# Altium project Ali_Main_Board.PrjPCB
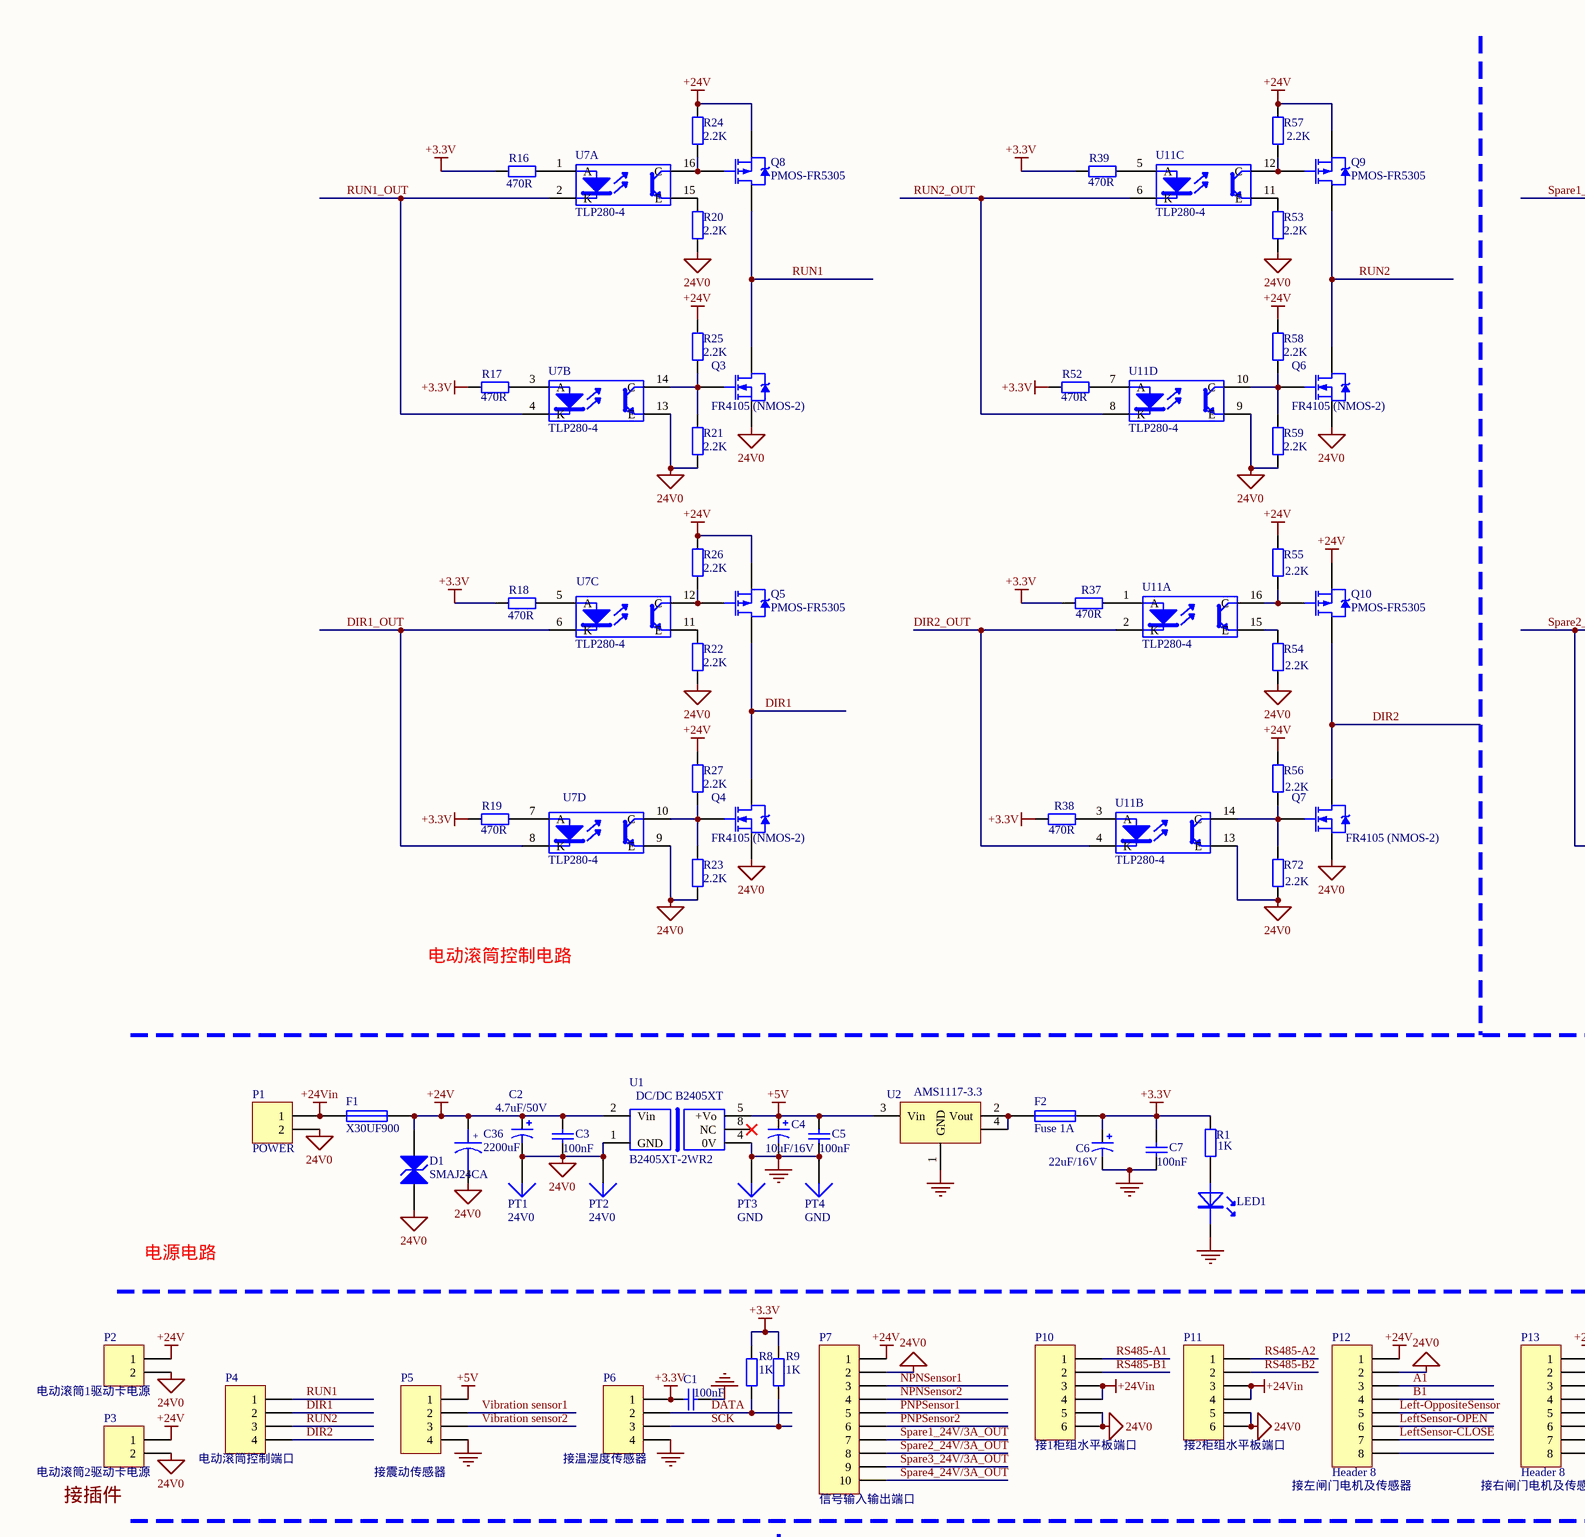
[diagram p0: Ali_Main_Board.SchDoc, top left]
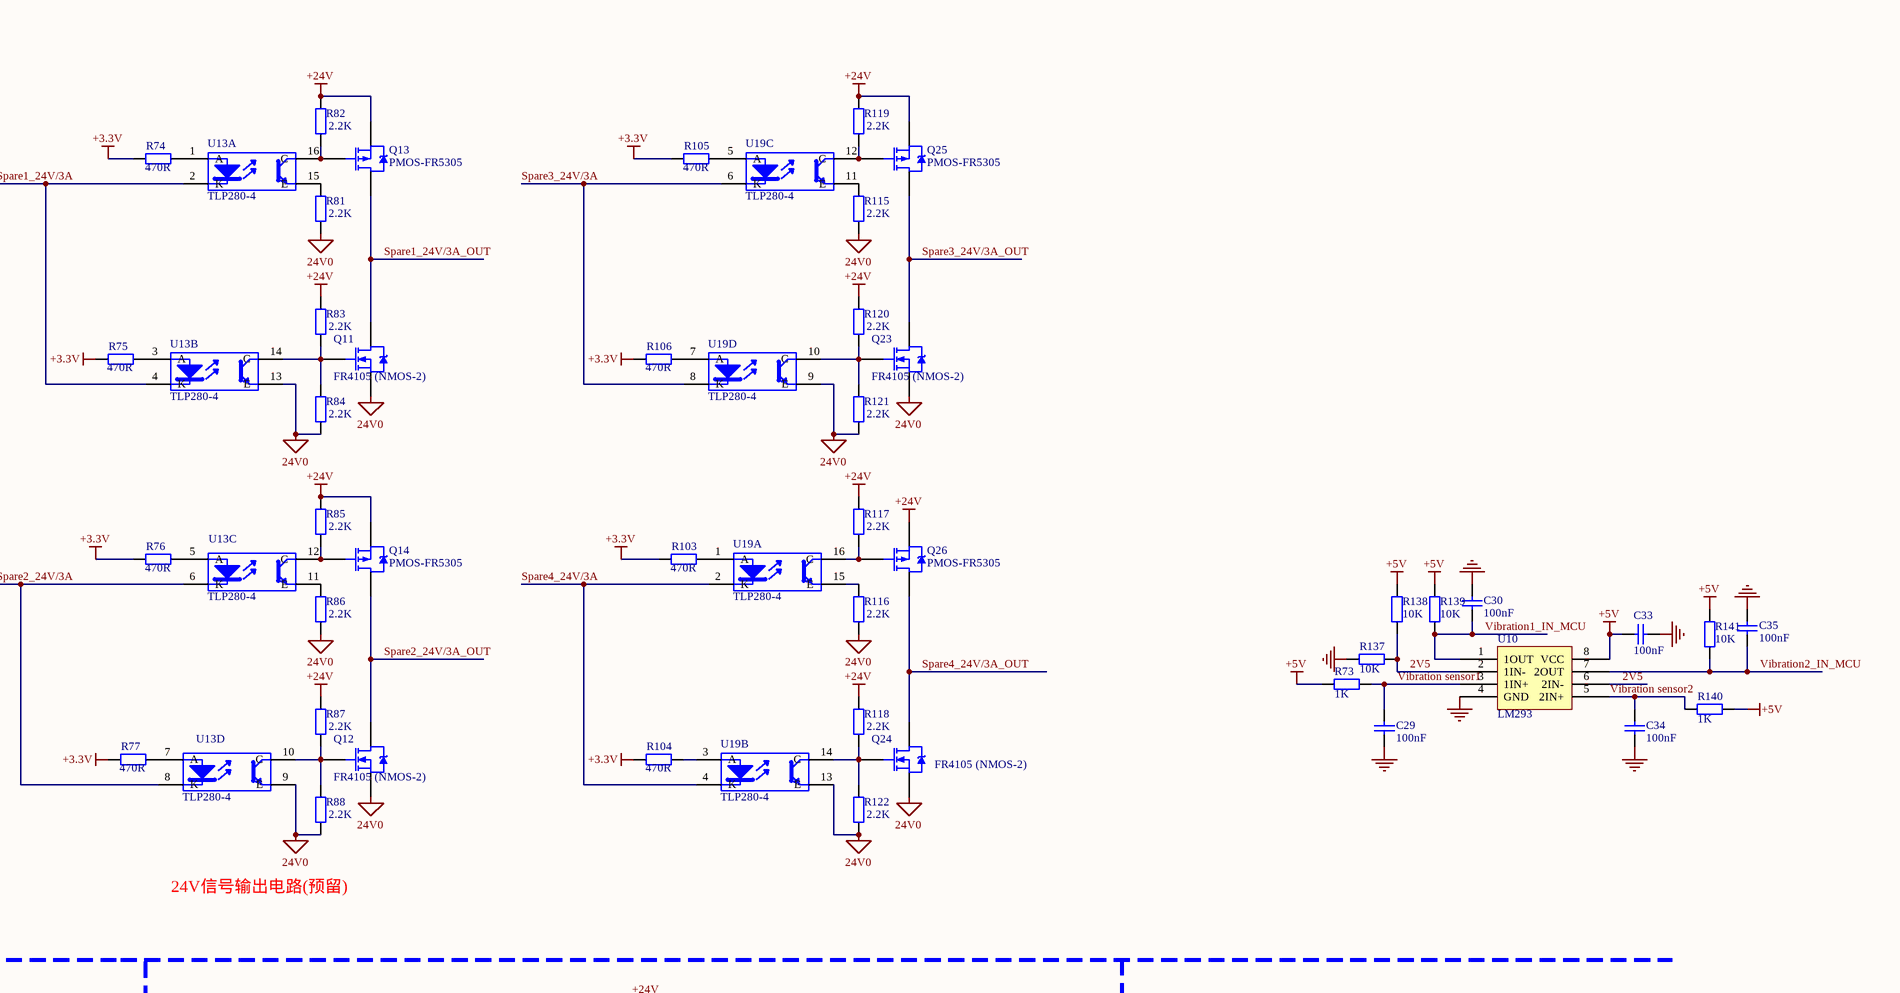
[diagram p1: Ali_Main_Board.SchDoc, top right]
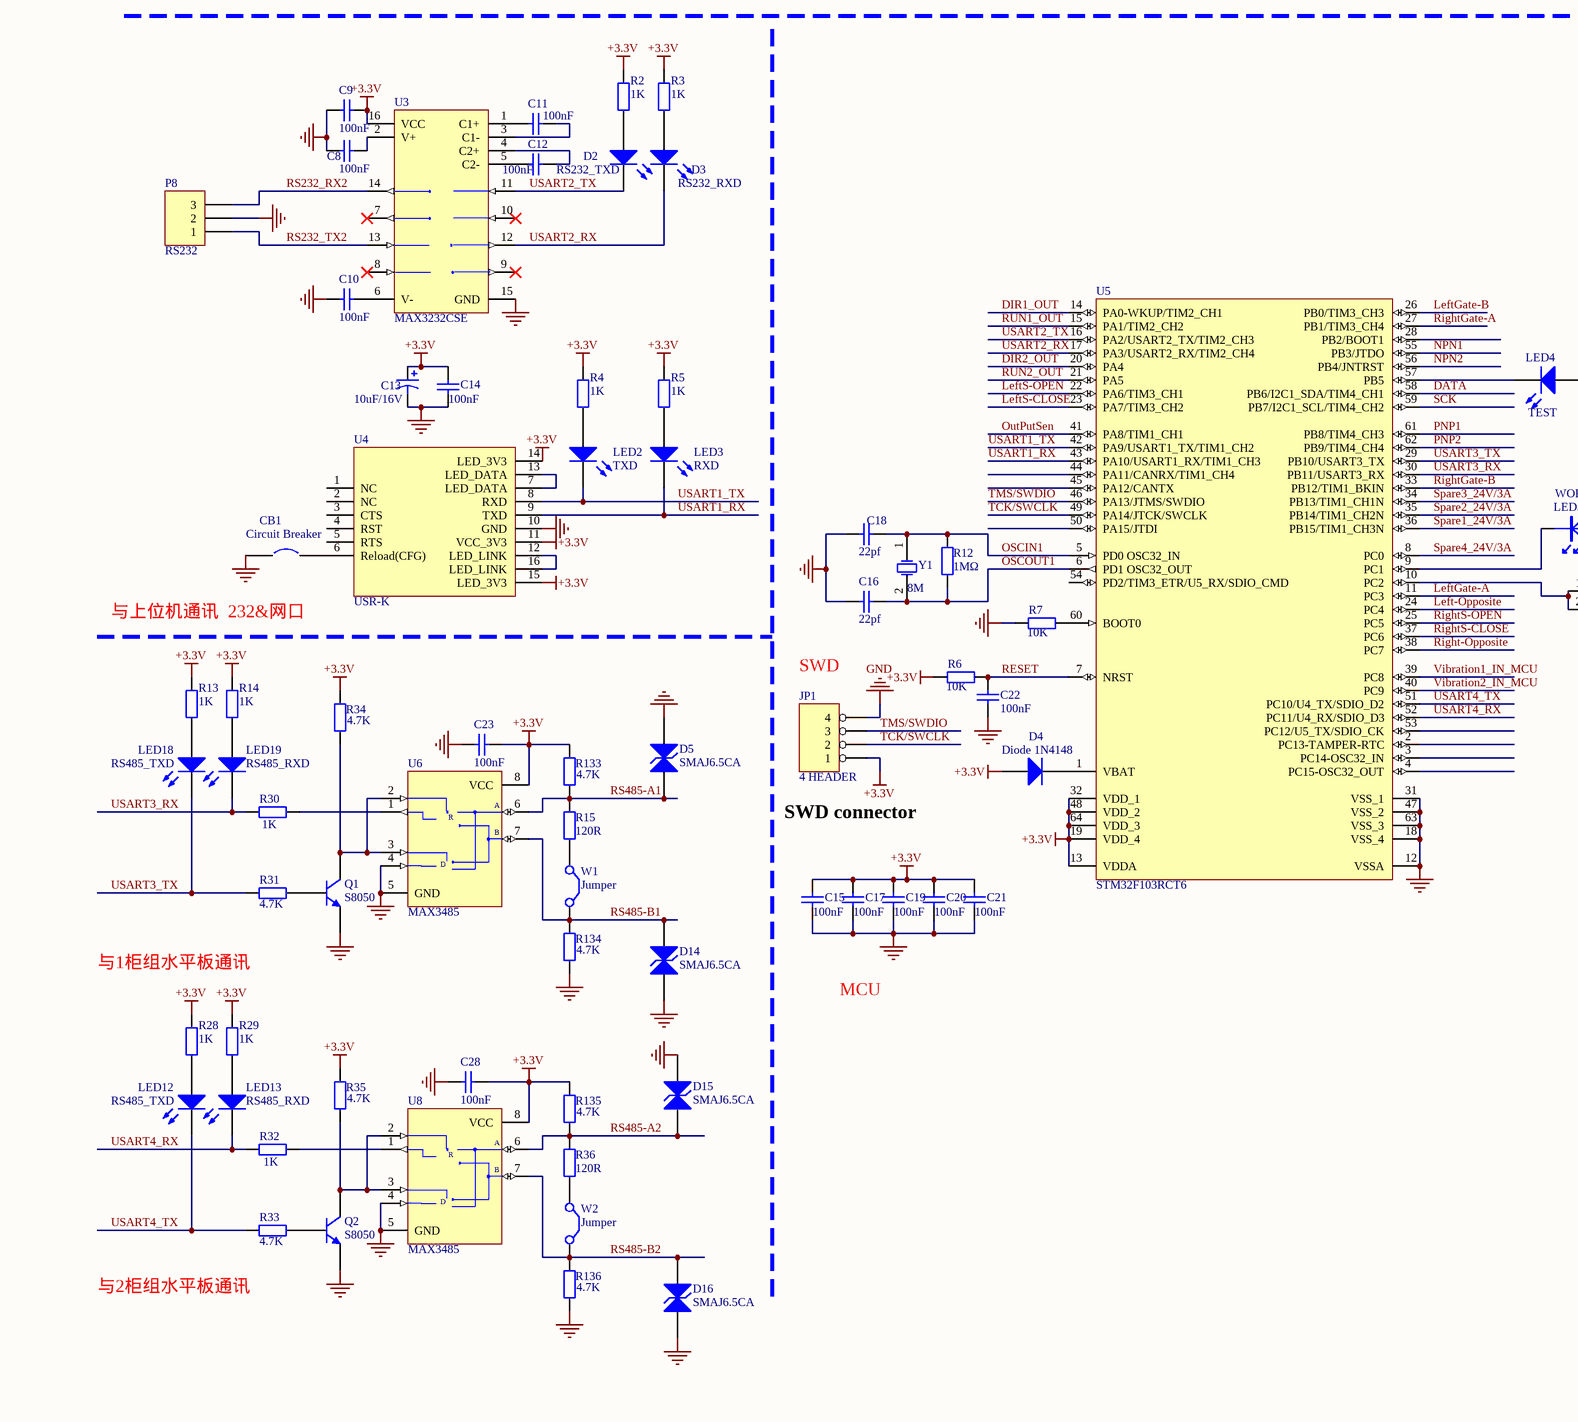
[diagram p2: Ali_Main_Board.SchDoc, bottom left]
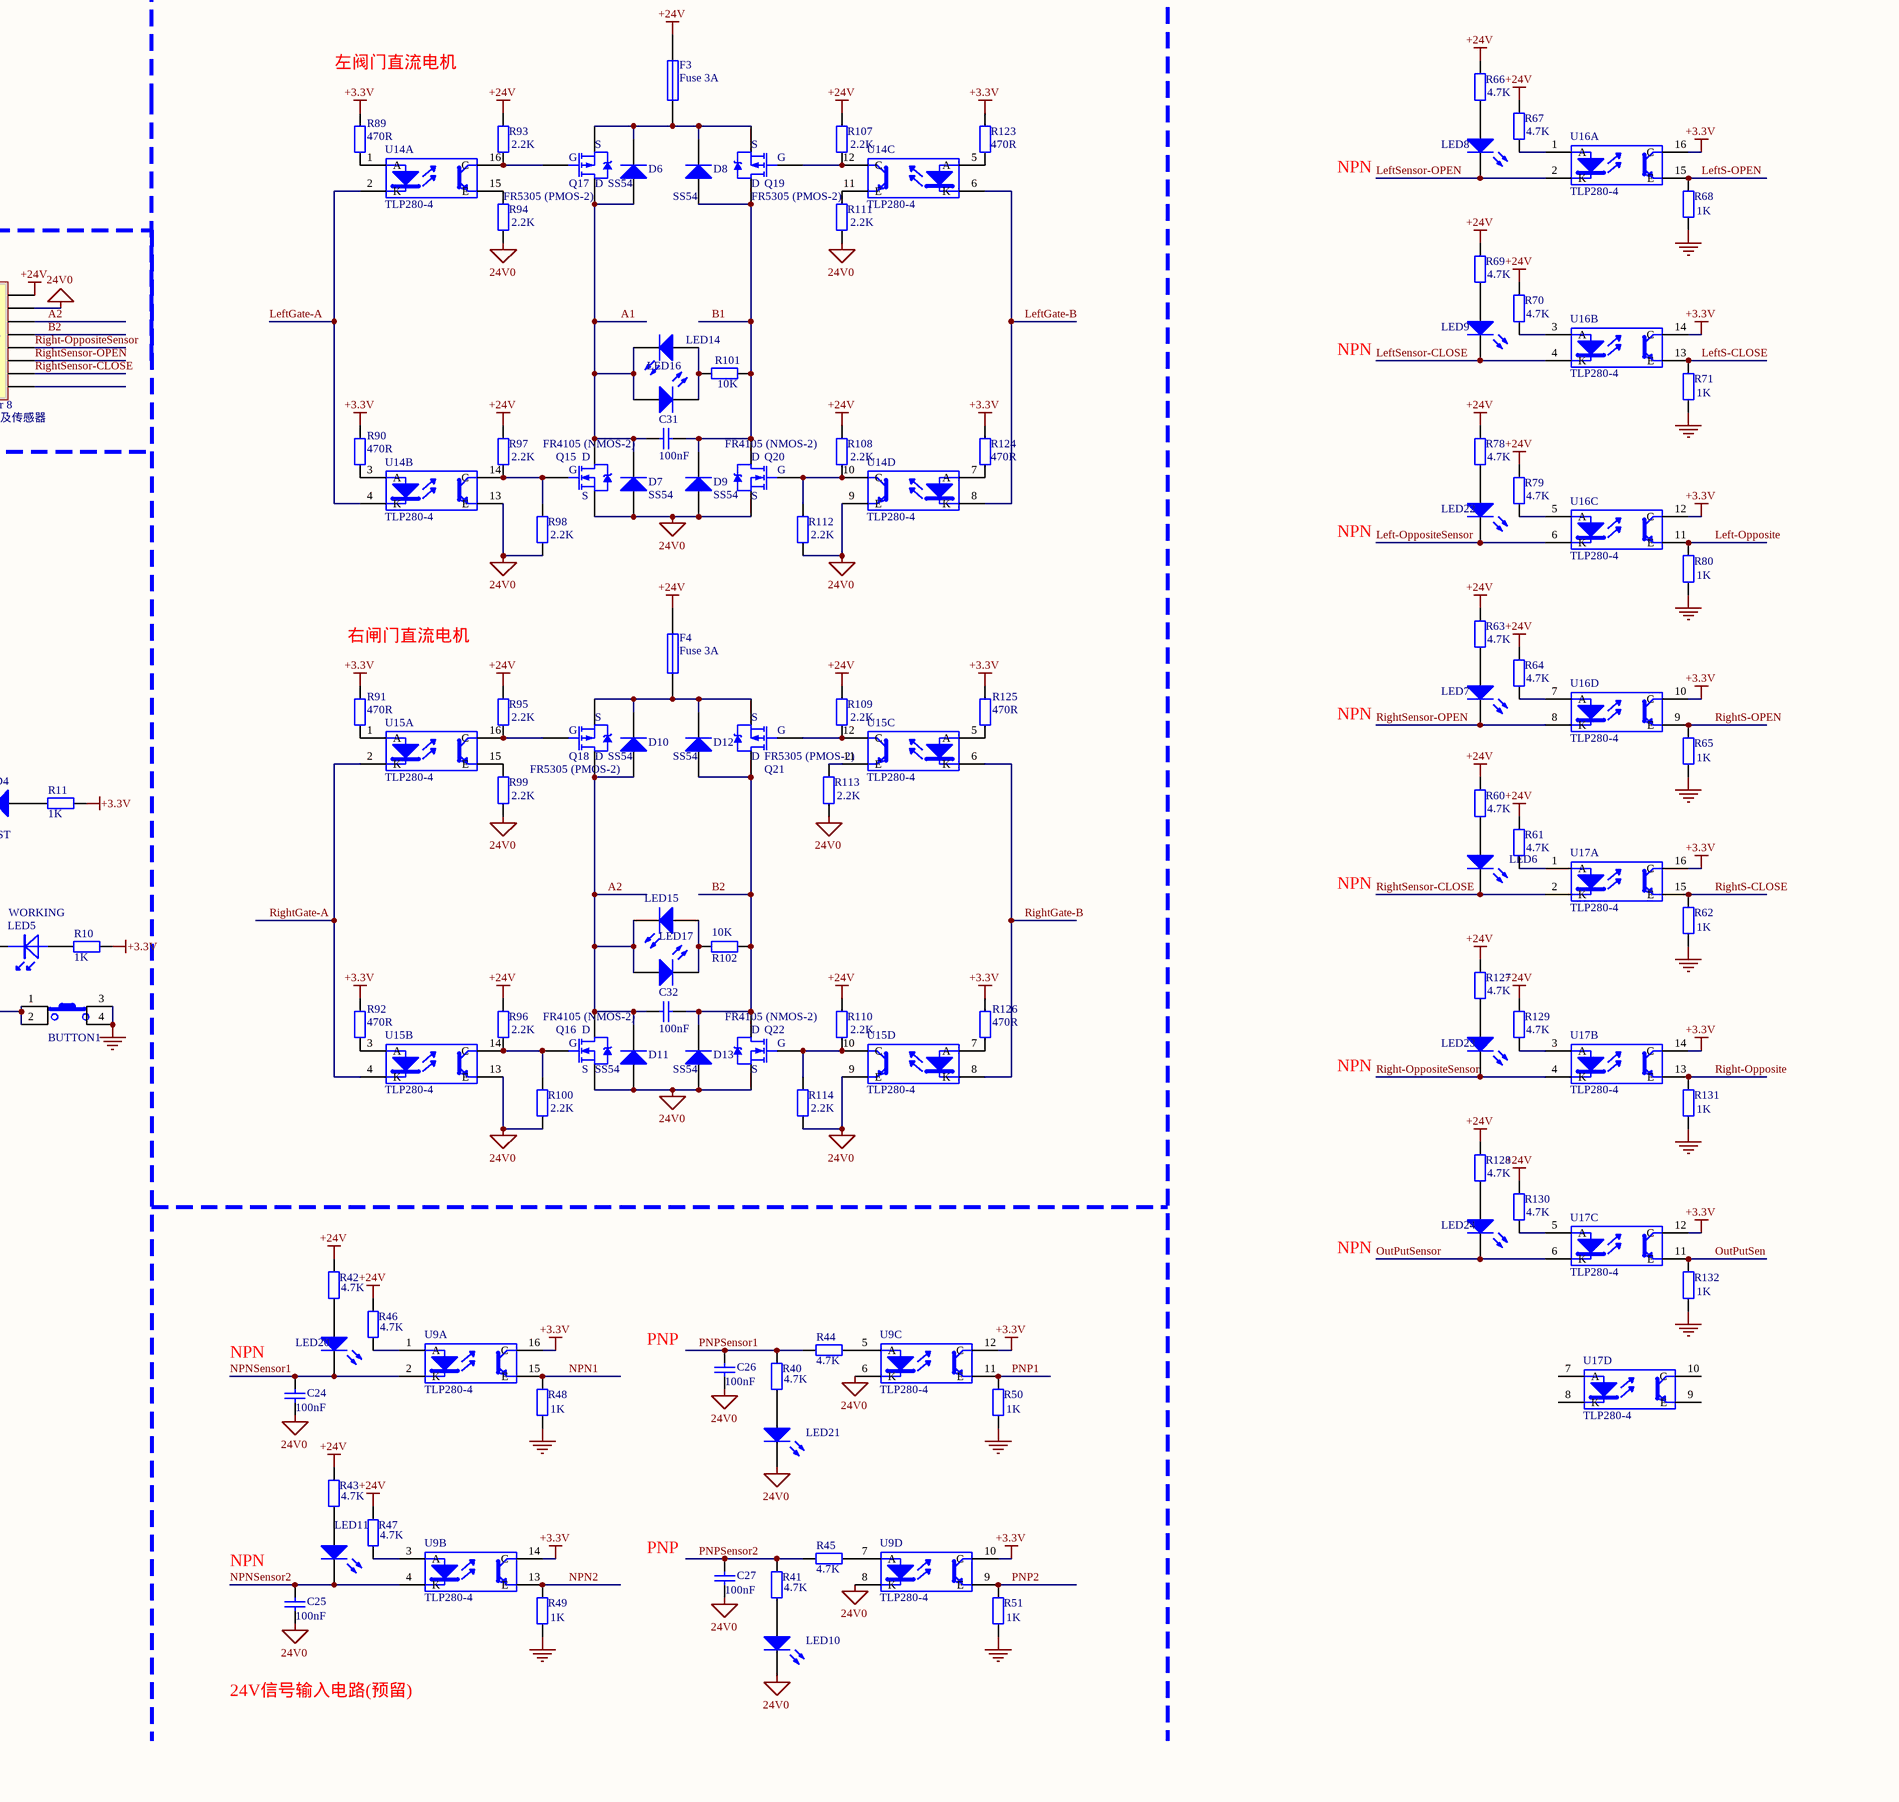
[diagram p3: Ali_Main_Board.SchDoc, bottom right]
1 sheet, 286 parts. Net scope: global (net labels, ports and power ports of the same name join across sheets).
Board file: Ali_Main_Board.PcbDoc

## Sheet Ali_Main_Board.SchDoc
size A1

### Parts
BUTTON1  SW4  [BUTTON]  (value not drawn)
C1  100nF  [0805]
C2  value 4.7uF/50V  [CAP D-7343]  (hidden comment: Cap Pol3)
C3  100nF  [0805]
C4  value 10uF/16V  [CAP A-3216]  (hidden comment: Cap Pol3)
C5  100nF  [0805]
C6  value 22uF/16V  [CAP D-7343]  (hidden comment: Cap Pol3)
C7  100nF  [0805]
C8  100nF  [0805]
C9  100nF  [0805]
C10  100nF  [0805]
C11  100nF  [0805]
C12  100nF  [0805]
C13  value 10uF/16V  [CAP A-3216]  (hidden comment: Cap Pol3)
C14  100nF  [0805]
C15  100nF  [0805]
C16  value 22pf  [0805]
C17  100nF  [0805]
C18  value 22pf  [0805]
C19  100nF  [0805]
C20  100nF  [0805]
C21  100nF  [0805]
C22  value 100nF  [0805]  (hidden comment: Cap)
C23  100nF  [0805]
C24  value 100nF  [0805]  (hidden comment: Cap)
C25  value 100nF  [0805]  (hidden comment: Cap)
C26  value 100nF  [0805]  (hidden comment: Cap)
C27  value 100nF  [0805]  (hidden comment: Cap)
C28  100nF  [0805]
C29  100nF  [0805]
C30  100nF  [0805]
C31  100nF  [0805]
C32  100nF  [0805]
C33  100nF  [0805]
C34  100nF  [0805]
C35  100nF  [0805]
C36  C_2200uF  [C7.8*17]  (value not drawn)
CB1  Circuit Breaker  [HDR1X2]
D1  SMAJ24CA  [SMB(DO-214AA)_S1]
D2  RS232_TXD  [LED-0805]
D3  RS232_RXD  [LED-0805]
D4  Diode 1N4148  [LED-0805]
D5  SMAJ6.5CA  [SMA(DO-214AC)_S1]
D6  SS54  [SMA]
D7  SS54  [SMA]
D8  SS54  [SMA]
D9  SS54  [SMA]
D10  SS54  [SMA]
D11  SS54  [SMA]
D12  SS54  [SMA]
D13  SS54  [SMA]
D14  SMAJ6.5CA  [SMA(DO-214AC)_S1]
D15  SMAJ6.5CA  [SMA(DO-214AC)_S1]
D16  SMAJ6.5CA  [SMA(DO-214AC)_S1]
F1  X30UF900  [X30UF900]
F2  Fuse 1A  [3225[1210]]
F3  Fuse 3A  [3225[1210]]
F4  Fuse 3A  [3225[1210]]
JP1  4 HEADER  [CON4_1.5]
LED1  LED  [LED-0805]  (value not drawn)
LED2  TXD  [LED-0805]
LED3  RXD  [LED-0805]
LED4  TEST  [LED-0805]
LED5  WORKING  [LED-0805]
LED6  LED  [LED-0805]  (value not drawn)
LED7  LED  [LED-0805]  (value not drawn)
LED8  LED  [LED-0805]  (value not drawn)
LED9  LED  [LED-0805]  (value not drawn)
LED10  LED  [LED-0805]  (value not drawn)
LED11  LED  [LED-0805]  (value not drawn)
LED12  RS485_TXD  [LED-0805]
LED13  RS485_RXD  [LED-0805]
LED14  LED  [LED-0805]  (value not drawn)
LED15  LED  [LED-0805]  (value not drawn)
LED16  LED  [LED-0805]  (value not drawn)
LED17  LED  [LED-0805]  (value not drawn)
LED18  RS485_TXD  [LED-0805]
LED19  RS485_RXD  [LED-0805]
LED20  LED  [LED-0805]  (value not drawn)
LED21  LED  [LED-0805]  (value not drawn)
LED22  LED  [LED-0805]  (value not drawn)
LED23  LED  [LED-0805]  (value not drawn)
LED24  LED  [LED-0805]  (value not drawn)
P1  POWER  [VH3.96  2PIN]
P2  电动滚筒1驱动卡电源  [VH3.96  2PIN]
P3  电动滚筒2驱动卡电源  [VH3.96  2PIN]
P4  电动滚筒控制端口  [VH3.96  4PIN]
P5  接震动传感器  [VH3.96  4PIN]
P6  接温湿度传感器  [VH3.96  4PIN]
P7  信号输入输出端口  [VH3.96  10PIN]
P8  RS232  [VH3.96  3PIN]
P10  接1柜组水平板端口  [VH3.96  6PIN]
P11  接2柜组水平板端口  [VH3.96  6PIN]
P12  Header 8  [VH3.96  8PIN]
P13  Header 8  [VH3.96  8PIN]
PT1  24V0  [PLUG]
PT2  24V0  [PLUG]
PT3  GND  [PLUG]
PT4  GND  [PLUG]
Q1  S8050  [SOT-23(SOT-23-3)]
Q2  S8050  [SOT-23(SOT-23-3)]
Q3  FR4105 (NMOS-2)  [TO-252]
Q4  FR4105 (NMOS-2)  [TO-252]
Q5  PMOS-FR5305  [TO-252]
Q6  FR4105 (NMOS-2)  [TO-252]
Q7  FR4105 (NMOS-2)  [TO-252]
Q8  PMOS-FR5305  [TO-252]
Q9  PMOS-FR5305  [TO-252]
Q10  PMOS-FR5305  [TO-252]
Q11  FR4105 (NMOS-2)  [TO-252]
Q12  FR4105 (NMOS-2)  [TO-252]
Q13  PMOS-FR5305  [TO-252]
Q14  PMOS-FR5305  [TO-252]
Q15  FR4105 (NMOS-2)  [TO-252]
Q16  FR4105 (NMOS-2)  [TO-252]
Q17  FR5305 (PMOS-2)  [TO-252]
Q18  FR5305 (PMOS-2)  [TO-252]
Q19  FR5305 (PMOS-2)  [TO-252]
Q20  FR4105 (NMOS-2)  [TO-252]
Q21  FR5305 (PMOS-2)  [TO-252]
Q22  FR4105 (NMOS-2)  [TO-252]
Q23  FR4105 (NMOS-2)  [TO-252]
Q24  FR4105 (NMOS-2)  [TO-252]
Q25  PMOS-FR5305  [TO-252]
Q26  PMOS-FR5305  [TO-252]
R1  1K  [0805]
R2  1K  [0805]
R3  1K  [0805]
R4  1K  [0805]
R5  1K  [0805]
R6  10K  [0805]
R7  10K  [0805]
R8  1K  [0805]
R9  1K  [0805]
R10  1K  [0805]
R11  1K  [0805]
R12  1MΩ  [0805]
R13  1K  [0805]
R14  1K  [0805]
R15  120R  [0805]
R16  470R  [0805]
R17  470R  [0805]
R18  470R  [0805]
R19  470R  [0805]
R20  2.2K  [0805]
R21  2.2K  [0805]
R22  2.2K  [0805]
R23  2.2K  [0805]
R24  2.2K  [0805]
R25  2.2K  [0805]
R26  2.2K  [0805]
R27  2.2K  [0805]
R28  1K  [0805]
R29  1K  [0805]
R30  1K  [0805]
R31  4.7K  [0805]
R32  1K  [0805]
R33  4.7K  [0805]
R34  4.7K  [0805]
R35  4.7K  [0805]
R36  120R  [0805]
R37  470R  [0805]
R38  470R  [0805]
R39  470R  [0805]
R40  4.7K  [0805]
R41  4.7K  [0805]
R42  4.7K  [0805]
R43  4.7K  [0805]
R44  4.7K  [0805]
R45  4.7K  [0805]
R46  4.7K  [0805]
R47  4.7K  [0805]
R48  1K  [0805]
R49  1K  [0805]
R50  1K  [0805]
R51  1K  [0805]
R52  470R  [0805]
R53  2.2K  [0805]
R54  2.2K  [0805]
R55  2.2K  [0805]
R56  2.2K  [0805]
R57  2.2K  [0805]
R58  2.2K  [0805]
R59  2.2K  [0805]
R60  4.7K  [0805]
R61  4.7K  [0805]
R62  1K  [0805]
R63  4.7K  [0805]
R64  4.7K  [0805]
R65  1K  [0805]
R66  4.7K  [0805]
R67  4.7K  [0805]
R68  1K  [0805]
R69  4.7K  [0805]
R70  4.7K  [0805]
R71  1K  [0805]
R72  2.2K  [0805]
R73  1K  [0805]
R74  470R  [0805]
R75  470R  [0805]
R76  470R  [0805]
R77  470R  [0805]
R78  4.7K  [0805]
R79  4.7K  [0805]
R80  1K  [0805]
R81  2.2K  [0805]
R82  2.2K  [0805]
R83  2.2K  [0805]
R84  2.2K  [0805]
R85  2.2K  [0805]
R86  2.2K  [0805]
R87  2.2K  [0805]
R88  2.2K  [0805]
R89  470R  [0805]
R90  470R  [0805]
R91  470R  [0805]
R92  470R  [0805]
R93  2.2K  [0805]
R94  2.2K  [0805]
R95  2.2K  [0805]
R96  2.2K  [0805]
R97  2.2K  [0805]
R98  2.2K  [0805]
R99  2.2K  [0805]
R100  2.2K  [0805]
R101  10K  [0805]
R102  10K  [0805]
R103  470R  [0805]
R104  470R  [0805]
R105  470R  [0805]
R106  470R  [0805]
R107  2.2K  [0805]
R108  2.2K  [0805]
R109  2.2K  [0805]
R110  2.2K  [0805]
R111  2.2K  [0805]
R112  2.2K  [0805]
R113  2.2K  [0805]
R114  2.2K  [0805]
R115  2.2K  [0805]
R116  2.2K  [0805]
R117  2.2K  [0805]
R118  2.2K  [0805]
R119  2.2K  [0805]
R120  2.2K  [0805]
R121  2.2K  [0805]
R122  2.2K  [0805]
R123  value 470R  [0805]  (hidden comment: Res2)
R124  value 470R  [0805]  (hidden comment: Res2)
R125  470R  [0805]
R126  470R  [0805]
R127  4.7K  [0805]
R128  4.7K  [0805]
R129  4.7K  [0805]
R130  4.7K  [0805]
R131  1K  [0805]
R132  1K  [0805]
R133  4.7K  [0805]
R134  4.7K  [0805]
R135  4.7K  [0805]
R136  4.7K  [0805]
R137  10K  [0805]
R138  10K  [0805]
R139  10K  [0805]
R140  1K  [0805]
R141  10K  [0805]
U1  B2405XT-2WR2  [B2405XT-2WR2]
U2  AMS1117-3.3  [SOT223]
U3  MAX3232CSE  [SOIC-16_150mil]
U4  USR-K  [USR-K]
U5  STM32F103RCT6  [LQFP64_M]
U6  MAX3485  [AT24C512]
U7  TLP280-4  [SO16]  (parts A,B,C,D of 4)
U8  MAX3485  [AT24C512]
U9  TLP280-4  [SO16]  (parts A,B,C,D of 4)
U10  LM293  [SOIC-8_150mil]
U11  TLP280-4  [SO16]  (parts A,B,C,D of 4)
U13  TLP280-4  [SO16]  (parts A,B,C,D of 4)
U14  TLP280-4  [SO16]  (parts A,B,C,D of 4)
U15  TLP280-4  [SO16]  (parts A,B,C,D of 4)
U16  TLP280-4  [SO16]  (parts A,B,C,D of 4)
U17  TLP280-4  [SO16]  (parts A,B,C,D of 4)
U19  TLP280-4  [SO16]  (parts A,B,C,D of 4)
W1  Jumper  [HDR1X2]
W2  Jumper  [HDR1X2]
Y1  8M  [XTAL]

### Nets
24V0: C2.2 C3.1 C24.1 C25.1 C26.1 C27.1 C36.2 D1.1(A) D7.1(A) D9.1(A) D11.1(A) D13.1(A) LED10.2(K) LED21.2(K) P1.2 P2.2 P3.2 P7.2 P10.5 P10.6 P11.5 P11.6 P12.2 P13.2 PT1.1 PT2.1 Q3.3(S) Q4.3(S) Q6.3(S) Q7.3(S) Q11.3(S) Q12.3(S) Q15.3(S) Q16.3(S) Q20.3(S) Q22.3(S) Q23.3(S) Q24.3(S) R20.1 R21.1 R22.1 R23.1 R53.1 R54.1 R59.1 R72.1 R81.1 R84.1 R86.1 R88.1 R94.1 R98.1 R99.1 R100.1 R111.1 R112.1 R113.1 R114.1 R115.1 R116.1 R121.1 R122.1 U1.1(GND) U7.9(E) U7.13(E) U9.6(K) U9.8(K) U11.9(E) U11.13(E) U13.9(E) U13.13(E) U14.9(E) U14.13(E) U15.9(E) U15.13(E) U19.9(E) U19.13(E)
+3.3V: C1.2 C6.1 C7.2 C9.1 C13.1 C14.2 C15.2 C17.2 C19.2 C20.2 C21.2 C23.1 C28.1 D4.1(A) F2.2 JP1.1 P6.1 R1.1 R2.1 R3.1 R4.1 R5.1 R6.1 R8.1 R9.1 R10.1 R11.1 R13.1 R14.1 R16.2 R17.1 R18.1 R19.1 R28.1 R29.1 R34.1 R35.1 R37.1 R38.1 R39.2 R52.1 R74.2 R75.2 R76.2 R77.2 R89.1 R90.1 R91.1 R92.1 R103.2 R104.2 R105.2 R106.2 R123.2 R124.2 R125.1 R126.1 R133.1 R135.1 U3.16(VCC) U4.11(VCC_3V3) U4.14(LED_3V3) U4.15(LED_3V3) U5.13(VDDA) U5.19(VDD_4) U5.32(VDD_1) U5.48(VDD_2) U5.64(VDD_3) U6.8(VCC) U8.8(VCC) U9.10(C) U9.12(C) U9.14(C) U9.16(C) U16.10(C) U16.12(C) U16.14(C) U16.16(C) U17.12(C) U17.14(C) U17.16(C)
+5V: C4.1 C5.2 C33.2 P5.1 R73.1 R138.2 R139.2 R140.1 R141.2 U1.5(+Vo) U2.3(Vin) U10.8(VCC)
+24V: C2.1 C3.2 C36.1 D1.2(K) F1.2 F3.2 F4.2 P2.1 P3.1 P7.1 P12.1 P13.1 Q5.3(S) Q8.3(S) Q9.3(S) Q10.3(S) Q13.3(S) Q14.3(S) Q25.3(S) Q26.3(S) R24.2 R25.2 R26.2 R27.2 R42.1 R43.1 R46.1 R47.1 R55.2 R56.2 R57.2 R58.2 R60.1 R61.1 R63.1 R64.1 R66.1 R67.1 R69.1 R70.1 R78.1 R79.1 R82.2 R83.2 R85.2 R87.2 R93.2 R95.2 R96.2 R97.2 R107.2 R108.2 R109.2 R110.2 R117.2 R118.2 R119.2 R120.2 R127.1 R128.1 R129.1 R130.1 U1.2(Vin)
+24Vin: F1.1 P1.1 P10.3 P10.4 P11.3 P11.4
GND: BUTTON1.3 BUTTON1.4 C1.1 C4.2 C5.1 C6.2 C7.1 C8.2 C9.2 C10.2 C13.2 C14.1 C15.1 C16.1 C17.1 C18.1 C19.1 C20.1 C21.1 C22.1 C23.2 C28.2 C29.2 C30.1 C33.1 C34.2 C35.1 CB1.1 D5.2(K) D14.1(A) D15.2(K) D16.1(A) JP1.4 LED1.2 P5.4 P6.4 P8.2 PT3.1 PT4.1 Q1.2(E) Q2.2(E) R7.1 R48.1 R49.1 R50.1 R51.1 R62.1 R65.1 R68.1 R71.1 R80.1 R131.1 R132.1 R134.2 R136.2 R137.2 U1.4(0V) U2.1(GND) U3.15(GND) U4.10(GND) U5.12(VSSA) U5.18(VSS_4) U5.31(VSS_1) U5.47(VSS_2) U5.63(VSS_3) U6.4(DI) U6.5(GND) U8.4(DI) U8.5(GND) U10.4(GND)
2V5: R137.1 R138.1 U10.2(1IN-) U10.6(2IN-)
A1: C31.2 D6.1(A) D7.2(K) LED14.2(K) LED16.1(A) P12.3 Q15.2(D) Q17.2(D)
A2: C32.2 D10.1(A) D11.2(K) LED15.2(K) LED17.1(A) P13.3 Q16.2(D) Q18.2(D)
B1: C31.1 D8.1(A) D9.2(K) P12.4 Q19.2(D) Q20.2(D) R101.1
B2: C32.1 D12.1(A) D13.2(K) P13.4 Q21.2(D) Q22.2(D) R102.1
DATA: P6.2 R8.2 U5.58(PB6/I2C1_SDA/TIM4_CH1)
DIR1: P4.2 Q4.2(D) Q5.2(D)
DIR1_OUT: U5.14(PA0-WKUP/TIM2_CH1) U7.6(K) U7.8(K)
DIR2: P4.4 Q7.2(D) Q10.2(D)
DIR2_OUT: U5.20(PA4) U11.2(K) U11.4(K)
Left-Opposite: R80.2 U5.24(PC4) U16.11(E)
Left-OppositeSensor: LED22.2(K) P12.5 U16.6(K)
LeftGate-A: U5.11(PC3) U14.2(K) U14.4(K)
LeftGate-B: U5.26(PB0/TIM3_CH3) U14.6(K) U14.8(K)
LeftS-CLOSE: R71.2 U5.23(PA7/TIM3_CH2) U16.13(E)
LeftS-OPEN: R68.2 U5.22(PA6/TIM3_CH1) U16.15(E)
LeftSensor-CLOSE: LED9.2(K) P12.7 U16.4(K)
LeftSensor-OPEN: LED8.2(K) P12.6 U16.2(K)
NPN1: R48.2 U5.55(PB3/JTDO) U9.15(E)
NPN2: R49.2 U5.56(PB4/JNTRST) U9.13(E)
NPNSensor1: C24.2 LED20.2(K) P7.3 U9.2(K)
NPNSensor2: C25.2 LED11.2(K) P7.4 U9.4(K)
OSCIN1: C18.2 R12.2 U5.5(PD0_OSC32_IN) Y1.1(OSC1)
OSCOUT1: C16.2 R12.1 U5.6(PD1_OSC32_OUT) Y1.2(OSC2)
OutPutSen: R132.2 U5.41(PA8/TIM1_CH1) U17.11(E)
OutPutSensor: LED24.2(K) U17.6(K)
PNP1: R50.2 U5.61(PB8/TIM4_CH3) U9.11(E)
PNP2: R51.2 U5.62(PB9/TIM4_CH4) U9.9(E)
PNPSensor1: C26.2 P7.5 R40.1 R44.1
PNPSensor2: C27.2 P7.6 R41.1 R45.1
RESET: C22.2 R6.2 U5.7(NRST)
Right-Opposite: R131.2 U5.38(PC7) U17.13(E)
Right-OppositeSensor: LED23.2(K) P13.5 U17.4(K)
RightGate-A: U5.27(PB1/TIM3_CH4) U15.2(K) U15.4(K)
RightGate-B: U5.33(PB12/TIM1_BKIN) U15.6(K) U15.8(K)
RightS-CLOSE: R62.2 U5.37(PC6) U17.15(E)
RightS-OPEN: R65.2 U5.25(PC5) U16.9(E)
RightSensor-CLOSE: LED6.2(K) P13.7 U17.2(K)
RightSensor-OPEN: LED7.2(K) P13.6 U16.8(K)
RS232_RX2: P8.3 U3.14(T1OUT)
RS232_TX2: P8.1 U3.13(R1IN)
RS485-A1: D5.1(A) P10.1 R15.2 R133.2 U6.6(A)
RS485-A2: D15.1(A) P11.1 R36.2 R135.2 U8.6(A)
RS485-B1: D14.2(K) P10.2 R134.1 U6.7(B) W1.2(C2)
RS485-B2: D16.2(K) P11.2 R136.1 U8.7(B) W2.2(C2)
RUN1: P4.1 Q3.2(D) Q8.2(D)
RUN1_OUT: U5.15(PA1/TIM2_CH2) U7.2(K) U7.4(K)
RUN2: P4.3 Q6.2(D) Q9.2(D)
RUN2_OUT: U5.21(PA5) U11.6(K) U11.8(K)
SCK: P6.3 R9.2 U5.59(PB7/I2C1_SCL/TIM4_CH2)
Spare1_24V/3A: U5.36(PB15/TIM1_CH3N) U13.2(K) U13.4(K)
Spare1_24V/3A_OUT: P7.7 Q11.2(D) Q13.2(D)
Spare2_24V/3A: U5.35(PB14/TIM1_CH2N) U13.6(K) U13.8(K)
Spare2_24V/3A_OUT: P7.8 Q12.2(D) Q14.2(D)
Spare3_24V/3A: U5.34(PB13/TIM1_CH1N) U19.6(K) U19.8(K)
Spare3_24V/3A_OUT: P7.9 Q23.2(D) Q25.2(D)
Spare4_24V/3A: U5.8(PC0) U19.2(K) U19.4(K)
Spare4_24V/3A_OUT: P7.10 Q24.2(D) Q26.2(D)
TCK/SWCLK: JP1.2 U5.49(PA14/JTCK/SWCLK)
TMS/SWDIO: JP1.3 U5.46(PA13/JTMS/SWDIO)
USART1_RX: LED3.2(K) U4.9(TXD) U5.43(PA10/USART1_RX/TIM1_CH3)
USART1_TX: LED2.2(K) U4.8(RXD) U5.42(PA9/USART1_TX/TIM1_CH2)
USART2_RX: D3.2(K) U3.12(R1OUT) U5.17(PA3/USART2_RX/TIM2_CH4)
USART2_TX: D2.2(K) U3.11(T1IN) U5.16(PA2/USART2_TX/TIM2_CH3)
USART3_RX: LED19.2(K) R30.2 U5.30(PB11/USART3_RX)
USART3_TX: LED18.2(K) R31.1 U5.29(PB10/USART3_TX)
USART4_RX: LED13.2(K) R32.2 U5.52(PC11/U4_RX/SDIO_D3)
USART4_TX: LED12.2(K) R33.1 U5.51(PC10/U4_TX/SDIO_D2)
Vibration1_IN_MCU: C30.2 R139.1 U5.39(PC8) U10.1(1OUT)
Vibration2_IN_MCU: C35.2 R141.1 U5.40(PC9) U10.7(2OUT)
Vibration sensor1: C29.1 P5.2 R73.2 U10.3(1IN+)
Vibration sensor2: C34.1 P5.3 R140.2 U10.5(2IN+)
NetBUTTON1_1: BUTTON1.1 BUTTON1.2 U5.10(PC2)
NetC8_1: C8.1 U3.2(V+)
NetC10_1: C10.1 U3.6(V-)
NetC11_1: C11.1 U3.3(C1-)
NetC11_2: C11.2 U3.1(C1+)
NetC12_1: C12.1 U3.4(C2+)
NetC12_2: C12.2 U3.5(C2-)
NetCB1_2: CB1.2 U4.6(Reload(CFG))
NetD2_1: D2.1(A) R2.2
NetD3_1: D3.1(A) R3.2
NetD4_2: D4.2(K) U5.1(VBAT)
NetD6_2: D6.2(K) D8.2(K) F3.1 Q17.3(S) Q19.3(S)
NetD10_2: D10.2(K) D12.2(K) F4.1 Q18.3(S) Q21.3(S)
NetF2_1: F2.1 U2.2(Vout) U2.4
NetLED1_1: LED1.1 R1.2
NetLED2_1: LED2.1(A) R4.2
NetLED3_1: LED3.1(A) R5.2
NetLED4_1: LED4.1(A) R11.2
NetLED4_2: LED4.2(K) U5.57(PB5)
NetLED5_1: LED5.1 R10.2
NetLED5_2: LED5.2 U5.9(PC1)
NetLED6_1: LED6.1(A) R60.2
NetLED7_1: LED7.1(A) R63.2
NetLED8_1: LED8.1(A) R66.2
NetLED9_1: LED9.1(A) R69.2
NetLED10_1: LED10.1(A) R41.2
NetLED11_1: LED11.1(A) R43.2
NetLED12_1: LED12.1(A) R28.2
NetLED13_1: LED13.1(A) R29.2
NetLED14_1: LED14.1(A) LED16.2(K) R101.2
NetLED15_1: LED15.1(A) LED17.2(K) R102.2
NetLED18_1: LED18.1(A) R13.2
NetLED19_1: LED19.1(A) R14.2
NetLED20_1: LED20.1(A) R42.2
NetLED21_1: LED21.1(A) R40.2
NetLED22_1: LED22.1(A) R78.2
NetLED23_1: LED23.1(A) R127.2
NetLED24_1: LED24.1(A) R128.2
NetQ1_1: Q1.1(B) R31.2
NetQ1_3: Q1.3(C) R34.2 U6.2(~{RE}) U6.3(DE)
NetQ2_1: Q2.1(B) R33.2
NetQ2_3: Q2.3(C) R35.2 U8.2(~{RE}) U8.3(DE)
NetQ3_1: Q3.1(G) R21.2 R25.1 U7.14(C)
NetQ4_1: Q4.1(G) R23.2 R27.1 U7.10(C)
NetQ5_1: Q5.1(G) R26.1 U7.12(C)
NetQ6_1: Q6.1(G) R58.1 R59.2 U11.10(C)
NetQ7_1: Q7.1(G) R56.1 R72.2 U11.14(C)
NetQ8_1: Q8.1(G) R24.1 U7.16(C)
NetQ9_1: Q9.1(G) R57.1 U11.12(C)
NetQ10_1: Q10.1(G) R55.1 U11.16(C)
NetQ11_1: Q11.1(G) R83.1 R84.2 U13.14(C)
NetQ12_1: Q12.1(G) R87.1 R88.2 U13.10(C)
NetQ13_1: Q13.1(G) R82.1 U13.16(C)
NetQ14_1: Q14.1(G) R85.1 U13.12(C)
NetQ15_1: Q15.1(G) R97.1 R98.2 U14.14(C)
NetQ16_1: Q16.1(G) R96.1 R100.2 U15.14(C)
NetQ17_1: Q17.1(G) R93.1 U14.16(C)
NetQ18_1: Q18.1(G) R95.1 U15.16(C)
NetQ19_1: Q19.1(G) R107.1 U14.12(C)
NetQ20_1: Q20.1(G) R108.1 R112.2 U14.10(C)
NetQ21_1: Q21.1(G) R109.1 U15.12(C)
NetQ22_1: Q22.1(G) R110.1 R114.2 U15.10(C)
NetQ23_1: Q23.1(G) R120.1 R121.2 U19.10(C)
NetQ24_1: Q24.1(G) R118.1 R122.2 U19.14(C)
NetQ25_1: Q25.1(G) R119.1 U19.12(C)
NetQ26_1: Q26.1(G) R117.1 U19.16(C)
NetR7_2: R7.2 U5.60(BOOT0)
NetR15_1: R15.1 W1.1(C1)
NetR16_1: R16.1 U7.1(A)
NetR17_2: R17.2 U7.3(A)
NetR18_2: R18.2 U7.5(A)
NetR19_2: R19.2 U7.7(A)
NetR20_2: R20.2 U7.15(E)
NetR22_2: R22.2 U7.11(E)
NetR30_1: R30.1 U6.1(RO)
NetR32_1: R32.1 U8.1(RO)
NetR36_1: R36.1 W2.1(C1)
NetR37_2: R37.2 U11.1(A)
NetR38_2: R38.2 U11.3(A)
NetR39_1: R39.1 U11.5(A)
NetR44_2: R44.2 U9.5(A)
NetR45_2: R45.2 U9.7(A)
NetR46_2: R46.2 U9.1(A)
NetR47_2: R47.2 U9.3(A)
NetR52_2: R52.2 U11.7(A)
NetR53_2: R53.2 U11.11(E)
NetR54_2: R54.2 U11.15(E)
NetR61_2: R61.2 U17.1(A)
NetR64_2: R64.2 U16.7(A)
NetR67_2: R67.2 U16.1(A)
NetR70_2: R70.2 U16.3(A)
NetR74_1: R74.1 U13.1(A)
NetR75_1: R75.1 U13.3(A)
NetR76_1: R76.1 U13.5(A)
NetR77_1: R77.1 U13.7(A)
NetR79_2: R79.2 U16.5(A)
NetR81_2: R81.2 U13.15(E)
NetR86_2: R86.2 U13.11(E)
NetR89_2: R89.2 U14.1(A)
NetR90_2: R90.2 U14.3(A)
NetR91_2: R91.2 U15.1(A)
NetR92_2: R92.2 U15.3(A)
NetR94_2: R94.2 U14.15(E)
NetR99_2: R99.2 U15.15(E)
NetR103_1: R103.1 U19.1(A)
NetR104_1: R104.1 U19.3(A)
NetR105_1: R105.1 U19.5(A)
NetR106_1: R106.1 U19.7(A)
NetR111_2: R111.2 U14.11(E)
NetR113_2: R113.2 U15.11(E)
NetR115_2: R115.2 U19.11(E)
NetR116_2: R116.2 U19.15(E)
NetR123_1: R123.1 U14.5(A)
NetR124_1: R124.1 U14.7(A)
NetR125_2: R125.2 U15.5(A)
NetR126_2: R126.2 U15.7(A)
NetR129_2: R129.2 U17.3(A)
NetR130_2: R130.2 U17.5(A)
NetU4_7: U4.7(LED_DATA) U4.13(LED_DATA)
NetU4_12: U4.12(LED_LINK) U4.16(LED_LINK)

Not connected (* = marked no-connect by the designer): P12 8; P13 8; U1 8(NC)*; U3 7(T2OUT)* 8(R2IN)* 9(R2OUT)* 10(T2IN)*; U4 1(NC) 2(NC) 3(CTS) 4(RST) 5(RTS); U5 2(PC13-TAMPER-RTC) 3(PC14-OSC32_IN) 4(PC15-OSC32_OUT) 28(PB2/BOOT1) 44(PA11/CANRX/TIM1_CH4) 45(PA12/CANTX) 50(PA15/JTDI) 53(PC12/U5_TX/SDIO_CK) 54(PD2/TIM3_ETR/U5_RX/SDIO_CMD); U17 7(A) 8(K) 9(E) 10(C)

### Notes on the sheet
- 电动滚筒控制电路
- 24V信号输出电路(预留)
- 左阀门直流电机
- (near Q17) G
- (near Q17) S
- (near Q19) S
- (near Q19) G
- NPN
- 电源电路
- (near Q17) D
- (near Q19) D
- (near P12) 接左闸门电机及传感器
- (near P13) 接右闸门电机及传感器
- (near Q15) G
- (near Q15) D
- (near Q15) S
- (near Q20) D
- (near Q20) S
- (near Q20) G
- 右闸门直流电机
- (near Q18) G
- (near Q18) S
- (near Q18) D
- (near Q21) D
- (near Q21) S
- (near Q21) G
- 与上位机通讯  232&网口
- SWD
- (near Q16) G
- (near Q16) D
- (near Q16) S
- (near Q22) D
- (near Q22) S
- (near Q22) G
- (near JP1) SWD connector
- PNP
- 与1柜组水平板通讯
- MCU
- (near C24) NPN
- (near C25) NPN
- 与2柜组水平板通讯
- 24V信号输入电路(预留)
- Labels drawn without touching a wire or pin: 接插件
- (in symbol B2405XT-2WR2) DC/DC B2405XT
- (in symbol C_2200uF) +; 2200uF
- (in symbol MAX485CSA) R; D

### Library data of the parts
C1 C3 C5 C7-C12 C14-C35 = Cap: Capacitor; Published: 8-Jun-2000; LatestRevisionDate: 17-Jul-2002; LatestRevisionNote: Re-released for DXP Platform.; PackageReference: RAD-0.3; Publisher: Altium Limited
  C1 C3 C5 C7-C12 C14 C15 C17 C19-C21 C23 C28-C35: Value: 100nF
  C16 C18 C24-C27: PackageDescription: Radial Cap, Thru-Hole; 2 Leads; 0.3 in Pin Spacing
C2 C4 C6 C13 = Cap Pol3: Polarized Capacitor (Surface Mount); Published: 8-Jun-2000; LatestRevisionDate: 17-Jul-2002; LatestRevisionNote: Re-released for DXP Platform.; PackageReference: C0805; Publisher: Altium Limited
D1 D5 D14-D16 = SMB/DO-214AA P6SMB6.8CA: TVS; ComponentLink1Description: 供应商链接; ComponentLink1URL: http://www.szlcsc.com/product/details_79530.html; Package: SMB/DO-214AA; Supplier: LC; SuppliersPartNumber: C78395
D2 D3 LED2-LED4 LED6-LED24 = LED2: Typical RED, GREEN, YELLOW, AMBER GaAs LED; Published: 8-Jun-2000; LatestRevisionDate: 17-Jul-2002; LatestRevisionNote: Re-released for DXP Platform.; PackageDocument: Feb-2002; PackageReference: 3.2X1.6X1.1; Publisher: Altium Limited
D4 D6-D13 = Diode 1N4148: High Conductance Fast Diode; Published: 8-Jun-2000; LatestRevisionDate: 17-Jul-2002; LatestRevisionNote: Re-released for DXP Platform.; DatasheetDocument: 1997; PackageReference: DO-35; Publisher: Altium Limited; Code_JEDEC: DO-204-AH; ComponentLink1Description: Manufacturer Link; ComponentLink1URL: http://www.fairchildsemi.com/; ComponentLink2Description: Datasheet; ComponentLink2URL: http://www.fairchildsemi.com/ds/1N%2F1N4148.pdf
F1-F4 = Fuse 1: Fuse; Published: 8-Jun-2000; LatestRevisionDate: 17-Jul-2002; LatestRevisionNote: Re-released for DXP Platform.; PackageReference: PIN-W2/E2.8; Publisher: Altium Limited
JP1 = 4 HEADER: 4 Pin Header
LED5 = LED
P1-P3 = Header 2: Header, 2-Pin; LatestRevisionDate: 17-Jul-2002; LatestRevisionNote: Re-released for DXP Platform.; Publisher: Altium Limited
P4-P6 = Header 4: Header, 4-Pin; LatestRevisionDate: 17-Jul-2002; LatestRevisionNote: Re-released for DXP Platform.; Publisher: Altium Limited
P7 = Header 10: Header, 10-Pin; LatestRevisionDate: 17-Jul-2002; LatestRevisionNote: Re-released for DXP Platform.; Publisher: Altium Limited
P8 = Header 3: Header, 3-Pin; LatestRevisionDate: 17-Jul-2002; LatestRevisionNote: Re-released for DXP Platform.; Publisher: Altium Limited
P10 P11 = Header 6: Header, 6-Pin; LatestRevisionDate: 17-Jul-2002; LatestRevisionNote: Re-released for DXP Platform.; Publisher: Altium Limited
P12 P13 = Header 8: Header, 8-Pin; LatestRevisionDate: 17-Jul-2002; LatestRevisionNote: Re-released for DXP Platform.; Publisher: Altium Limited
PT1-PT4 = Plug: LatestRevisionDate: 17-Jul-2002; LatestRevisionNote: Re-released for DXP Platform.; Publisher: Altium Limited
Q1 Q2 = SOT-23 SS8050 Y1: 三极管; ComponentLink1Description: 供应商链接; ComponentLink1URL: http://www.szlcsc.com/product/details_2507.html; Package: SOT-23; Supplier: LC; SuppliersPartNumber: C2150
Q3 Q4 Q6 Q7 Q11 Q12 Q15 Q16 Q20 Q22-Q24 = NMOS-2: N-Channel Power MOSFET; Note: Pin 2 is electrically connected to pin 4.; Published: 8-Jun-2000; LatestRevisionDate: 17-Jul-2002; LatestRevisionNote: Re-released for DXP Platform.; DatasheetDocument: PD-9.814; PackageReference: TO-220AB; Publisher: Altium Limited; Code_JEDEC: TO-220-AB; ComponentLink1Description: Manufacturer Link; ComponentLink1URL: http://www.irf.com/
Q5 Q8-Q10 Q13 Q14 Q17-Q19 Q21 Q25 Q26 = PMOS-2: P-Channel Power MOSFET; Note: Pin 4 not drawn and electrically connected to Pin 2.; Published: 8-Jun-2000; LatestRevisionDate: 17-Jul-2002; LatestRevisionNote: Re-released for DXP Platform.; DatasheetDocument: PD-9.390D; PackageReference: TO-220AB; Publisher: Altium Limited; Code_JEDEC: TO-220-AB; ComponentLink1Description: Manufacturer Link; ComponentLink1URL: http://www.irf.com/
R1-R141 = Res2: Resistor; Published: 8-Jun-2000; LatestRevisionDate: 17-Jul-2002; LatestRevisionNote: Re-released for DXP Platform.; PackageReference: AXIAL-0.4; Publisher: Altium Limited
  R1-R5 R8 R9 R13 R14 R28-R30 R32 R48-R51 R62 R65 R68 R71 R73 R80 R131 R132 R140: Value: 1K
  R6 R7 R137-R139 R141: PackageDescription: Axial Device, Thru-Hole; 2 Leads; 0.4 in Pin Spacing; Value: 10K
  R10 R11: PackageDescription: Axial Device, Thru-Hole; 2 Leads; 0.4 in Pin Spacing; Value: 1K
  R12: PackageDescription: Axial Device, Thru-Hole; 2 Leads; 0.4 in Pin Spacing; Value: 1MΩ
  R15 R36: PackageDescription: Axial Device, Thru-Hole; 2 Leads; 0.4 in Pin Spacing; Value: 120R
  R16-R19 R37-R39 R52 R74-R77 R103-R106: PackageDescription: Axial Device, Thru-Hole; 2 Leads; 0.4 in Pin Spacing; Value: 470R
  R20-R27 R53-R59 R72 R81-R88 R93-R100 R107-R122: PackageDescription: Axial Device, Thru-Hole; 2 Leads; 0.4 in Pin Spacing; Value: 2.2K
  R31 R33-R35 R40-R47 R60 R61 R63 R64 R66 R67 R69 R70 R78 R79 R127-R130 R133-R136: Value: 4.7K
  R89-R92 R125 R126: Value: 470R
  R101 R102: Value: 10K
U2 = AMS1117-5
U3 = MAX3232CSE: 3.0V TO 5.5V, Low-Power, up to 1Mbps, True RS-232 Transceiver Using Four 0.1礔 External Capacitor; Published: 16-Jan-2001; LatestRevisionDate: 13-Apr-2006; LatestRevisionNote: IPC-7351 Footprint Added.; DatasheetVersion: Mar-1999; PackageReference: NSO16; Publisher: Altium Limited; PackageDescription: 16-Pin Small Outline Integrated Circuit 1.27 mm Pitch; Code_JEDEC: MS-012-AC; Code_IPC: SOIC127P600-16; ComponentLink1Description: Manufacturer Link; ComponentLink1URL: http://www.maxim-ic.com/; ComponentLink2Description: Datasheet; ComponentLink2URL: http://pdfserv.maxim-ic.com/en/ds/MAX3222-MAX3241.pdf
U6 U8 = MAX485CSA: Low-Power, Slew-Rate-Limited RS-485/RS-422 Transceiver; Published: 16-Jan-2001; LatestRevisionDate: 13-Apr-2006; LatestRevisionNote: IPC-7351 Footprint Added.; DatasheetVersion: Feb-1996; PackageReference: NSO8; Publisher: Altium Limited; PackageDescription: 8-Pin Small Outline Integrated Circuit 1.27 mm Pitch; Code_JEDEC: MS-012-AA; Code_IPC: SOIC127P600-8; ComponentLink1Description: Manufacturer Link; ComponentLink1URL: http://www.maxim-ic.com/; ComponentLink2Description: Datasheet; ComponentLink2URL: http://pdfserv.maxim-ic.com/en/ds/MAX1487-MAX491.pdf
U7 U9 U11 U13-U17 U19 = TLP521-4
W1 W2 = Jumper: Jumper Wire; Published: 24-Mar-1999; LatestRevisionDate: 17-Jul-2002; LatestRevisionNote: Re-released for DXP Platform.; PackageReference: RAD-0.2; Publisher: Altium Limited; PackageDescription: Radial Cap, Thru-Hole; 2 Leads; 0.2 in Pin Spacing
Y1 = XTAL_1
CB1 = Circuit Breaker: Published: 24-Mar-1999; LatestRevisionDate: 17-Jul-2002; LatestRevisionNote: Re-released for DXP Platform.; PackageReference: SPST-2; Publisher: Altium Limited; PackageDescription: Switch; 2 Leads